# EAGLE design grndstn (EAGLE 5.07)
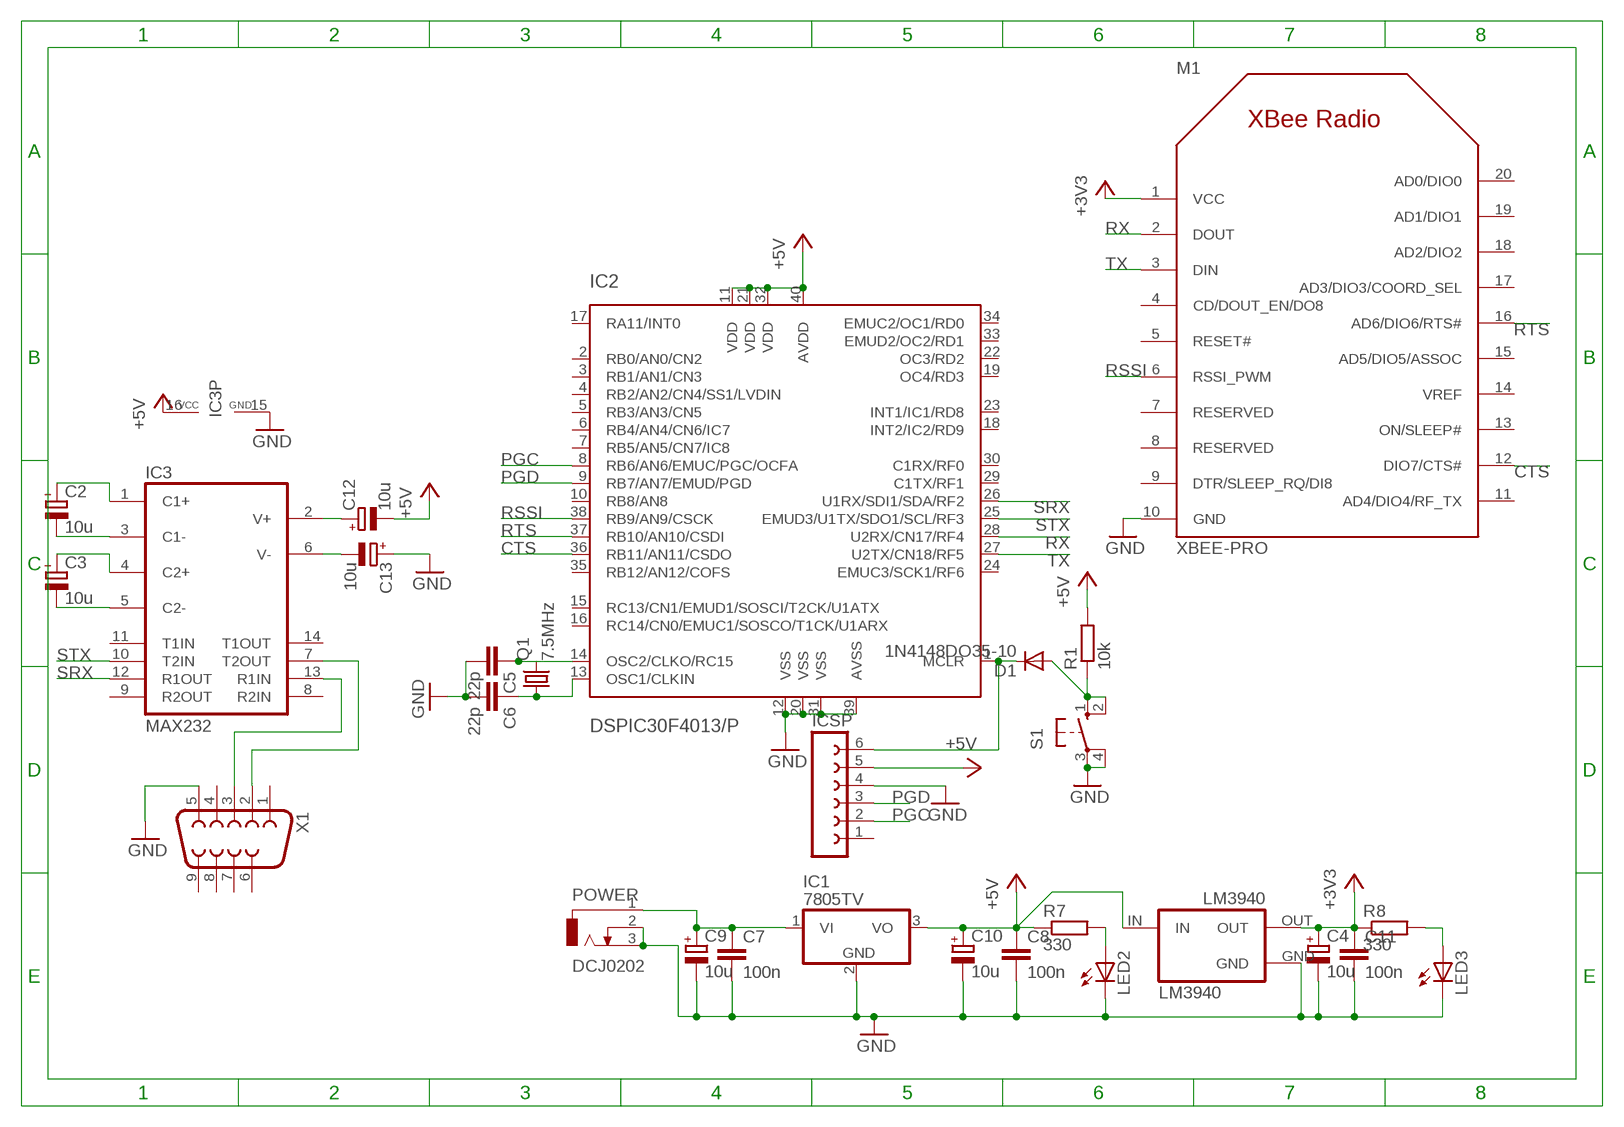
[diagram p0: schematic, sheet 1]

## Parts
C2  10u  CPOL-EUB45181A  [B45181A]
C3  10u  CPOL-EUB45181A  [B45181A]
C4  10u  CPOL-EUB45181A  [B45181A]
C5  22p  C-EU050-025X075  [C050-025X075]
C6  22p  C-EU050-025X075  [C050-025X075]
C7  100n  C-EU050-025X075  [C050-025X075]
C8  100n  C-EU050-025X075  [C050-025X075]
C9  10u  CPOL-EUB45181A  [B45181A]
C10  10u  CPOL-EUB45181A  [B45181A]
C11  100n  C-EU050-025X075  [C050-025X075]
C12  10u  CPOL-EUB45181A  [B45181A]
C13  10u  CPOL-EUB45181A  [B45181A]
D1  1N4148DO35-10  [DO35-10]
IC1  7805TV  [TO220V]
IC2  DSPIC30F4013/P  [DIL40]
IC3  MAX232  [DIL16]
ICSP  FE06-1  [FE06]
LED2  LED3MM  [LED3MM]
LED3  LED3MM  [LED3MM]
LM3940  LM3940  [TO220(V)]
M1  XBEE-PRO  [XBEE-PRO]
POWER  DCJ0202  [DCJ0202]
Q1  7.5MHz  CRYSTALHC18U-V  [HC18U-V]
R1  10k  R-EU_0207/10  [0207/10]
R7  330  R-EU_0207/10  [0207/10]
R8  330  R-EU_0207/10  [0207/10]
S1  10-XX  [B3F-10XX]
X1  F09HP  [F09HP]

## Nets
+3V3: C4.+ C11.1 LM3940.OUT M1.1(VCC) R8.1
+5V: C8.1 C10.+ C12.- IC1.3(VO) IC2.11(VDD) IC2.21(VDD) IC2.32(VDD) IC2.40(AVDD) IC3.16(VCC) ICSP.5 LM3940.IN R1.2 R7.1
CTS: IC2.36(RB11/AN11/CSDO) M1.12(DIO7/CTS#)
GND: C4.- C5.2 C6.2 C7.2 C8.2 C9.- C10.- C11.2 C13.+ IC1.2(GND) IC2.12(VSS) IC2.20(VSS) IC2.31(VSS) IC2.39(AVSS) IC3.15(GND) ICSP.4 LED2.K(C) LED3.K(C) LM3940.GND M1.10(GND) POWER.2 POWER.3 S1.3(P) S1.4(P1) X1.5
MCLR: D1.C IC2.1(MCLR) ICSP.6
N$1: LED3.A R8.2
N$2: C5.1 IC2.14(OSC2/CLKO/RC15) Q1.2
N$3: C12.+ IC3.2(V+)
N$4: C6.1 IC2.13(OSC1/CLKIN) Q1.1
N$5: C13.- IC3.6(V-)
N$6: C2.+ IC3.1(C1+)
N$7: C7.1 C9.+ IC1.1(VI) POWER.1
N$8: C2.- IC3.3(C1-)
N$9: C3.+ IC3.4(C2+)
N$10: C3.- IC3.5(C2-)
N$11: IC3.7(T2OUT) X1.2
N$12: IC3.13(R1IN) X1.3
N$14: D1.A R1.1 S1.1(S) S1.2(S1)
N$16: LED2.A R7.2
PGC: IC2.8(RB6/AN6/EMUC/PGC/OCFA) ICSP.2
PGD: IC2.9(RB7/AN7/EMUD/PGD) ICSP.3
RSSI: IC2.38(RB9/AN9/CSCK) M1.6(RSSI_PWM)
RTS: IC2.37(RB10/AN10/CSDI) M1.16(AD6/DIO6/RTS#)
RX: IC2.28(U2RX/CN17/RF4) M1.2(DOUT)
SRX: IC2.26(U1RX/SDI1/SDA/RF2) IC3.12(R1OUT)
STX: IC2.25(EMUD3/U1TX/SDO1/SCL/RF3) IC3.10(T2IN)
TX: IC2.27(U2TX/CN18/RF5) M1.3(DIN)
Unconnected: IC2.2(RB0/AN0/CN2) IC2.3(RB1/AN1/CN3) IC2.4(RB2/AN2/CN4/SS1/LVDIN) IC2.5(RB3/AN3/CN5) IC2.6(RB4/AN4/CN6/IC7) IC2.7(RB5/AN5/CN7/IC8) IC2.10(RB8/AN8) IC2.15(RC13/CN1/EMUD1/SOSCI/T2CK/U1ATX) IC2.16(RC14/CN0/EMUC1/SOSCO/T1CK/U1ARX) IC2.17(RA11/INT0) IC2.18(INT2/IC2/RD9) IC2.19(OC4/RD3) IC2.22(OC3/RD2) IC2.23(INT1/IC1/RD8) IC2.24(EMUC3/SCK1/RF6) IC2.29(C1TX/RF1) IC2.30(C1RX/RF0) IC2.33(EMUD2/OC2/RD1) IC2.34(EMUC2/OC1/RD0) IC2.35(RB12/AN12/COFS) IC3.8(R2IN) IC3.9(R2OUT) IC3.11(T1IN) IC3.14(T1OUT) ICSP.1 M1.4(CD/DOUT_EN/DO8) M1.5(RESET#) M1.7(RESERVED) M1.8(RESERVED) M1.9(DTR/SLEEP_RQ/DI8) M1.11(AD4/DIO4/RF_TX) M1.13(ON/SLEEP#) M1.14(VREF) M1.15(AD5/DIO5/ASSOC) M1.17(AD3/DIO3/COORD_SEL) M1.18(AD2/DIO2) M1.19(AD1/DIO1) M1.20(AD0/DIO0) X1.1 X1.4 X1.6 X1.7 X1.8 X1.9

## Library data of the parts
C2-C4 C9 C10 C12 C13 = rcl:CPOL-EU: POLARIZED CAPACITOR, European symbol
C5-C8 C11 = rcl:C-EU: CAPACITOR, European symbol
D1 = diode:1N4148: DIODE high speed (Philips)
IC1 = linear:78*: Positive VOLTAGE REGULATOR Source: http://cache.national.com/ds/LM/LM78L05.pdf http://www.fairchildsemi.com/ds/LM/LM7805.pdf
IC2 = microchip-dspic:DSPIC30F4013: dsPIC General DSC with CAN and CoDec ports
IC3 = maxim:MAX232: RS232 TRANSEIVER
ICSP = con-lsta:FE06-1: FEMALE HEADER
LED2 LED3 = led:LED: LED OSRAM: - CHIPLED LG R971, LG N971, LY N971, LG Q971, LY Q971, LO R971, LY R971 LH N974, LH R974 LS Q976, LO Q976, LY Q976 LO Q996 - Hyper CHIPLED LW Q18S LB Q993, LB Q99A, LB R99A - SideLED LS A670, LO A670, LY A670, LG A670, LP A670 LB A673, LV A673, LT A673, LW A673 LH A674 LY A675 LS A676, LA A676, LO A676, LY A676, LW A676 LS A679, LY A679, LG A679 - Hyper Micro SIDELED® LS Y876, LA Y876, LO Y876, LY Y876 LT Y87S - SmartLED LW L88C, LW L88S LB L89C, LB L89S, LG L890 LS L89K, LO L89K, LY L89K LS L896, LA L896, LO L896, LY L896 - TOPLED LS T670, LO T670, LY T670, LG T670, LP T670 LSG T670, LSP T670, LSY T670, LOP T670, LYG T670 LG T671, LOG T671, LSG T671 LB T673, LV T673, LT T673, LW T673 LH T674 LS T676, LA T676, LO T676, LY T676, LB T676, LH T676, LSB T676, LW T676 LB T67C, LV T67C, LT T67C, LS T67K, LO T67K, LY T67K, LW E67C LS E67B, LA E67B, LO E67B, LY E67B, LB E67C, LV E67C, LT E67C LW T67C LS T679, LY T679, LG T679 LS T770, LO T770, LY T770, LG T770, LP T770 LB T773, LV T773, LT T773, LW T773 LH T774 LS E675, LA E675, LY E675, LS T675 LS T776, LA T776, LO T776, LY T776, LB T776 LHGB T686 LT T68C, LB T68C - Hyper Mini TOPLED® LB M676 - Mini TOPLED Santana® LG M470 LS M47K, LO M47K, LY M47K Source: http://www.osram.convergy.de LUXEON: - LUMILED® LXK2-PW12-R00, LXK2-PW12-S00, LXK2-PW14-U00, LXK2-PW14-V00 LXK2-PM12-R00, LXK2-PM12-S00, LXK2-PM14-U00 LXK2-PE12-Q00, LXK2-PE12-R00, LXK2-PE12-S00, LXK2-PE14-T00, LXK2-PE14-U00 LXK2-PB12-K00, LXK2-PB12-L00, LXK2-PB12-M00, LXK2-PB14-N00, LXK2-PB14-P00, LXK2-PB14-Q00 LXK2-PR12-L00, LXK2-PR12-M00, LXK2-PR14-Q00, LXK2-PR14-R00 LXK2-PD12-Q00, LXK2-PD12-R00, LXK2-PD12-S00 LXK2-PH12-R00, LXK2-PH12-S00 LXK2-PL12-P00, LXK2-PL12-Q00, LXK2-PL12-R00 Source: www.luxeon.com KINGBRIGHT: KA-3528ASYC Source: www.kingbright.com
LM3940 = lm2937:LM3940
M1 = xbee_r1:XBEE
POWER = con-jack:DCJ0202: DC POWER JACK Source: DCJ0202.pdf
Q1 = crystal:CRYSTAL: CRYSTAL
R1 R7 R8 = rcl:R-EU_: RESISTOR, European symbol
S1 = switch-omron:10-XX: OMRON SWITCH
X1 = con-subd:F09: SUB-D

## Board
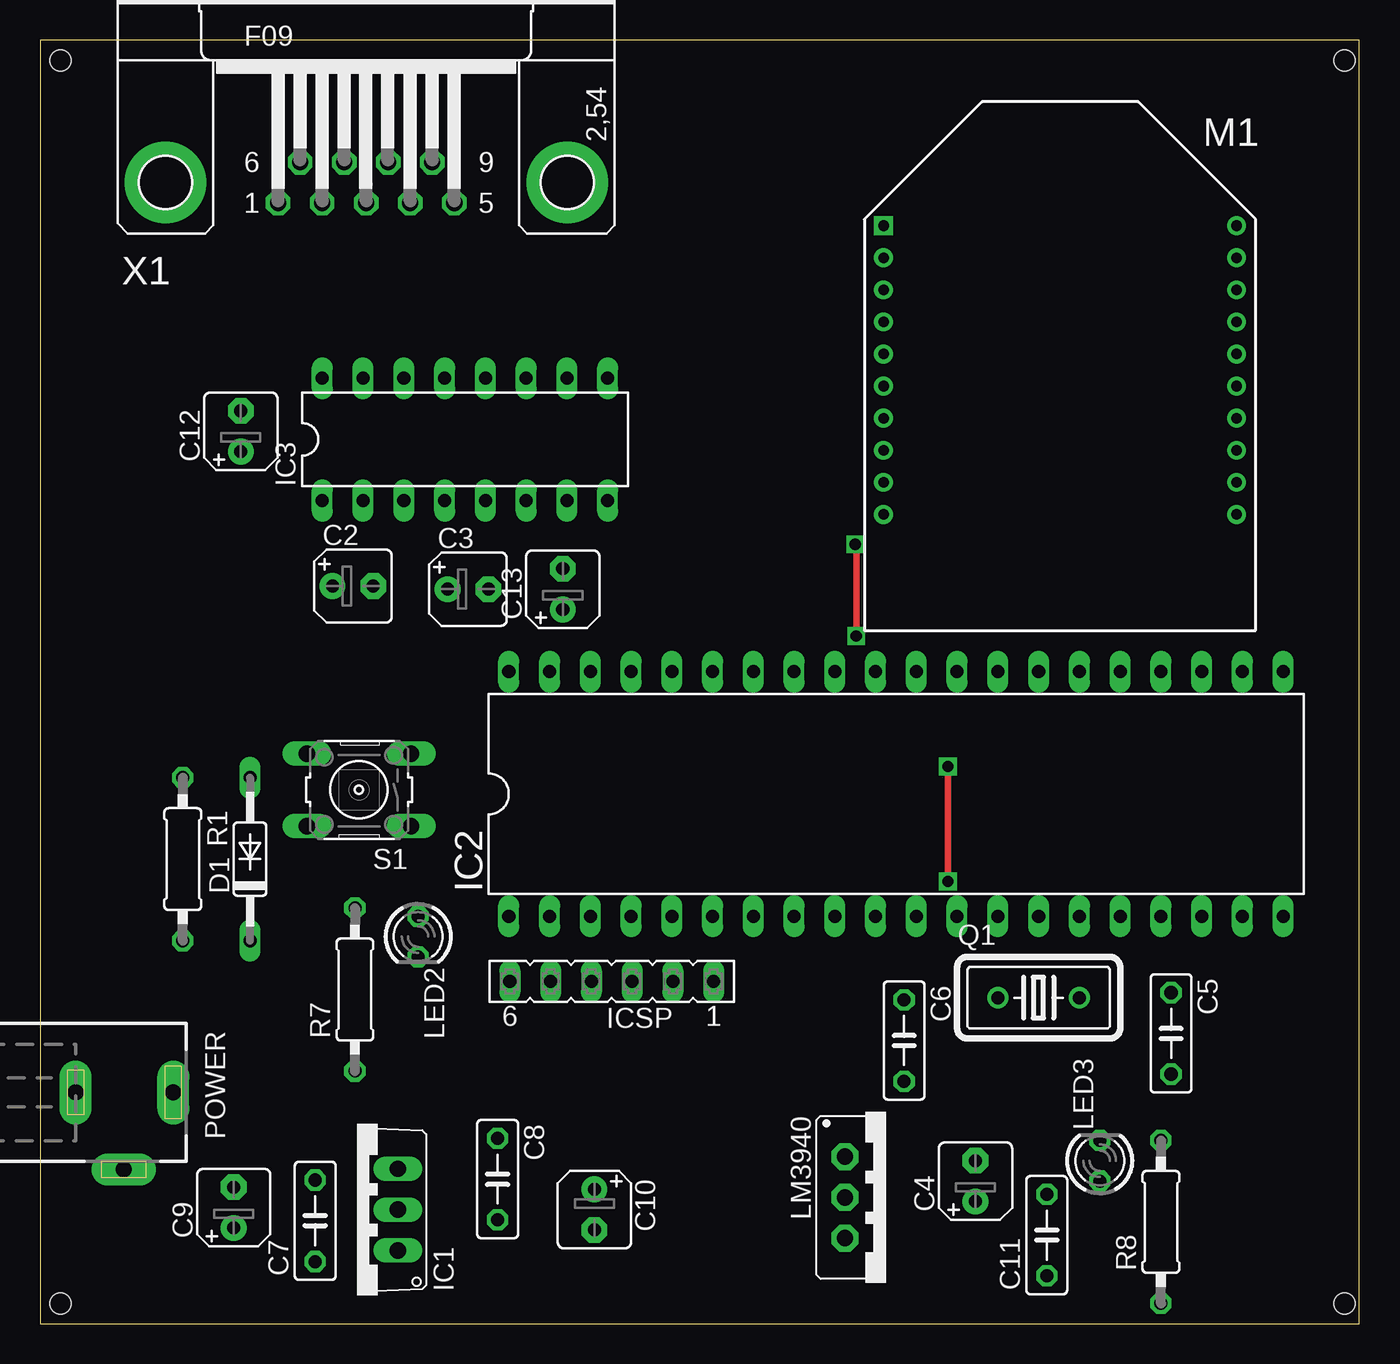
[diagram p1: board, top side]
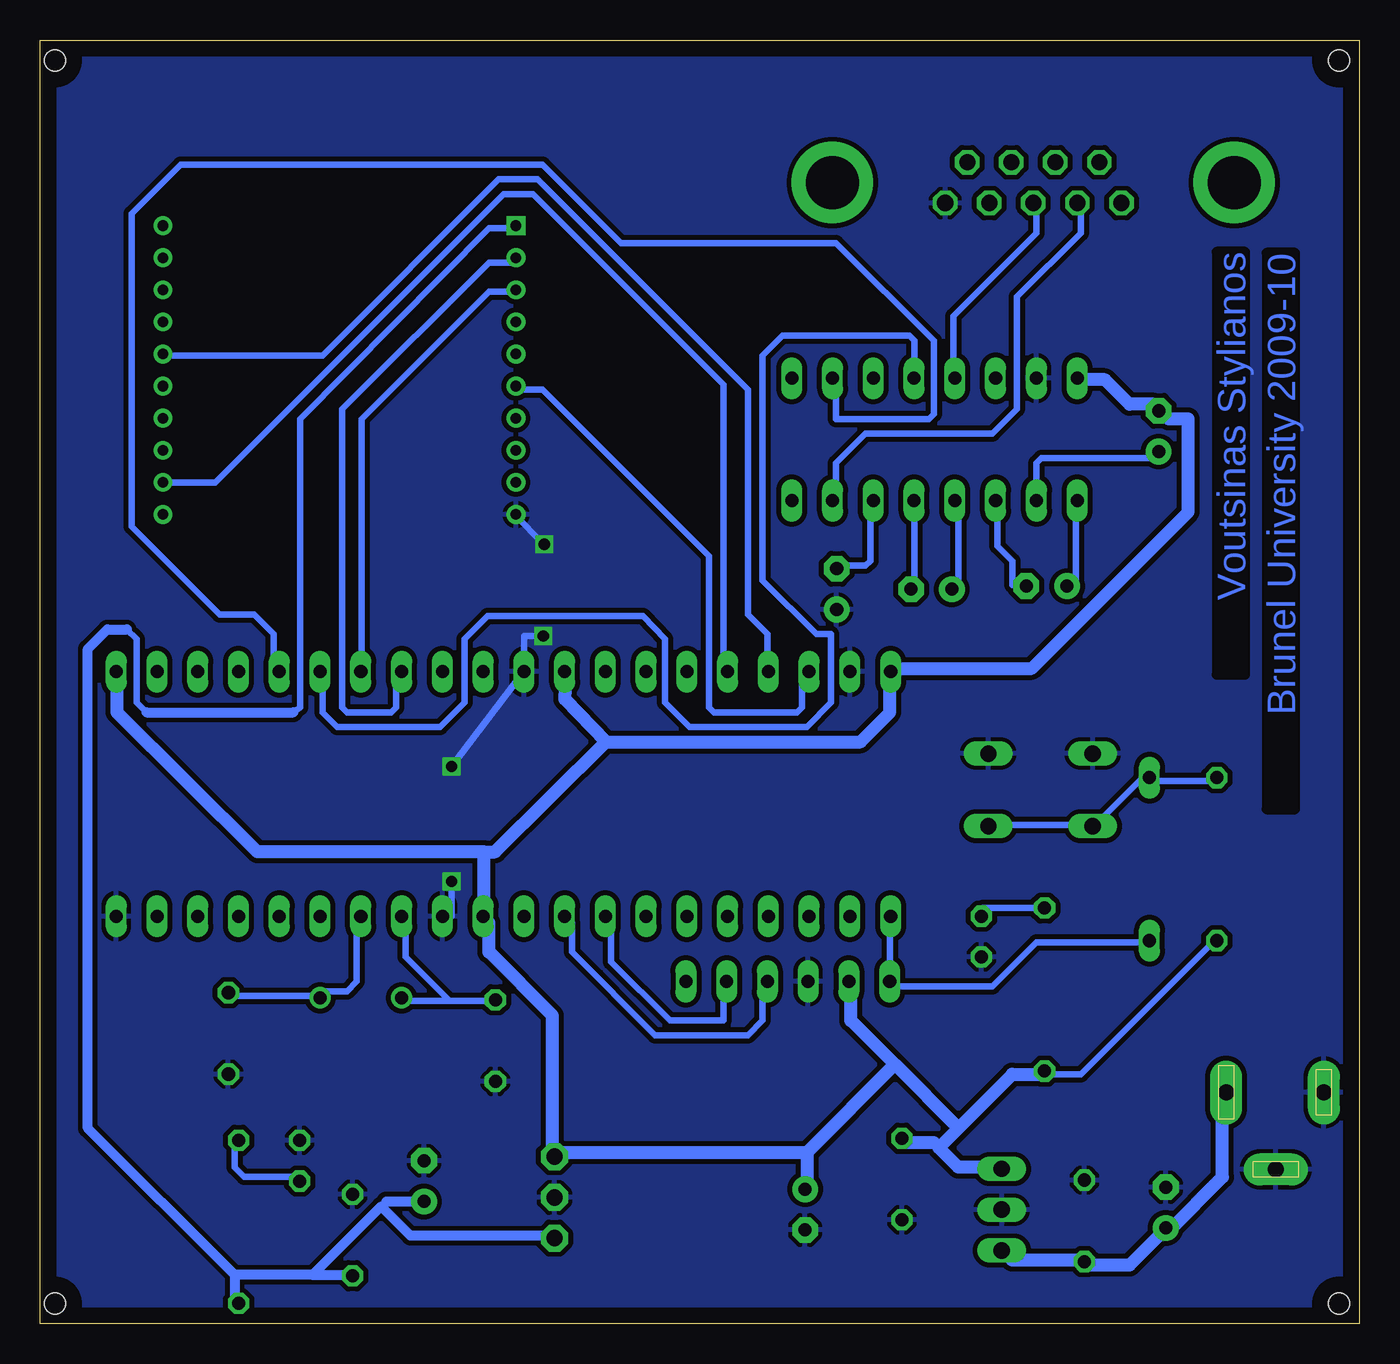
[diagram p2: board, bottom side, seen from below]

Size 82.22 x 80 mm. Coordinates in mm from the lower left corner, seen from the top.
Outline: 0,0 82.22,0 82.22,80 0,80 0,0
Copper layers (1*16): Top 0.035mm / dielectric 1.5mm / Bottom 0.035mm
Design rules "default *": minimum track width 16mil, minimum drill 24mil, track to track 12mil, track to pad 12mil, pad to pad 8mil, via to via 8mil, smd to smd 8mil, copper to edge 40mil, drill to drill 8mil, minimum pad ring 10mil, minimum via ring 8mil, stop-mask expansion 4mil, vias tented up to drill 0mil, thermal gap 10mil
Holes 1.3 mm at 1.27,78.74 1.27,1.27 81.28,78.74 81.28,1.27

### Footprints (pad centres in the part's own frame; a part is rotated, then mirrored left to right if it is on the bottom)
B45181A = drill 0.813 pad 1.6 round: + -1.27,0 | drill 0.813 pad 1.6 octagon: - 1.27,0
C050-025X075 = drill 0.813 octagon: 1 -2.54,0; 2 2.54,0
DO35-10 = drill 0.813 long: A 5.08,0; C -5.08,0
TO220V = drill 1.016 long: 1 -2.54,-2.54; 2 0,-2.54; 3 2.54,-2.54
DIL40 = drill 0.813 long: 1 -24.13,-7.62; 2 -21.59,-7.62; 3 -19.05,-7.62; 4 -16.51,-7.62; 5 -13.97,-7.62; 6 -11.43,-7.62; 7 -8.89,-7.62; 8 -6.35,-7.62; 9 -3.81,-7.62; 10 -1.27,-7.62; 11 1.27,-7.62; 12 3.81,-7.62; 13 6.35,-7.62; 14 8.89,-7.62; 15 11.43,-7.62; 16 13.97,-7.62; 17 16.51,-7.62; 18 19.05,-7.62; 19 21.59,-7.62; 20 24.13,-7.62; 21 24.13,7.62; 22 21.59,7.62; 23 19.05,7.62; 24 16.51,7.62; 25 13.97,7.62; 26 11.43,7.62; 27 8.89,7.62; 28 6.35,7.62; 29 3.81,7.62; 30 1.27,7.62; 31 -1.27,7.62; 32 -3.81,7.62; 33 -6.35,7.62; 34 -8.89,7.62; 35 -11.43,7.62; 36 -13.97,7.62; 37 -16.51,7.62; 38 -19.05,7.62; 39 -21.59,7.62; 40 -24.13,7.62
DIL16 = drill 0.813 long: 1 -8.89,-3.81; 2 -6.35,-3.81; 3 -3.81,-3.81; 4 -1.27,-3.81; 5 1.27,-3.81; 6 3.81,-3.81; 7 6.35,-3.81; 8 8.89,-3.81; 9 8.89,3.81; 10 6.35,3.81; 11 3.81,3.81; 12 1.27,3.81; 13 -1.27,3.81; 14 -3.81,3.81; 15 -6.35,3.81; 16 -8.89,3.81
FE06 = drill 0.813 long: 1 -6.35,0; 2 -3.81,0; 3 -1.27,0; 4 1.27,0; 5 3.81,0; 6 6.35,0
LED3MM = drill 0.813 octagon: A -1.27,0; K 1.27,0
TO220(V) = drill 1.016 pad 1.676 octagon: GND 0,0; IN -2.54,0; OUT 2.54,0
XBEE-PRO = drill 0.66 square: 1 -11,9 | drill 0.66 round: 2 -11,7; 3 -11,5; 4 -11,3; 5 -11,1; 6 -11,-1; 7 -11,-3; 8 -11,-5; 9 -11,-7; 10 -11,-9; 11 11,-9; 12 11,-7; 13 11,-5; 14 11,-3; 15 11,-1; 16 11,1; 17 11,3; 18 11,5; 19 11,7; 20 11,9
DCJ0202 = drill 1 pad 2 long: 1 0,3.1; 2 4.8,0; 3 0,-3
HC18U-V = drill 0.813 round: 1 -2.54,0; 2 2.54,0
0207/10 = drill 0.813 octagon: 1 -5.08,0; 2 5.08,0
B3F-10XX = drill 1.016 long: 1 -3.251,2.261; 2 3.251,2.261; 3 -3.251,-2.261; 4 3.251,-2.261
F09HP = drill 1.016 octagon: 1 -5.486,-1.27; 2 -2.743,-1.27; 3 0,-1.27; 4 2.743,-1.27; 5 5.486,-1.27; 6 -4.115,1.27; 7 -1.372,1.27; 8 1.372,1.27; 9 4.115,1.27 | drill 3.302 pad 5.08 round: G1 -12.522,0; G2 12.522,0

### Placement (x,y rotation side)
C2  19.49,45.97 0 top
C3  26.67,45.78 0 top
C4  58.29,8.89 90 top
C5  70.48,18.1 270 top
C6  53.85,17.65 270 top
C7  17.14,6.41 90 top
C8  28.51,9.02 270 top
C9  12.06,7.24 90 top
C10  34.54,7.11 270 top
C11  62.74,5.52 90 top
C12  12.51,55.63 90 top
C13  32.58,45.78 90 top
D1  13.08,28.96 90 top
IC1  19.75,7.11 90 top
IC2  53.34,33.02 0 top
IC3  26.48,55.12 0 top
ICSP  35.62,21.34 180 top
LED2  23.56,24.13 270 top
LED3  66.04,10.16 90 top
LM3940  50.16,7.87 270 top
M1  63.56,59.44 0 top
POWER  5.21,14.41 270 top
Q1  62.23,20.32 0 top
R1  8.89,28.96 270 top
R7  19.62,20.83 90 top
R8  69.85,6.35 90 top
S1  19.88,33.27 180 top
X1  20.32,71.12 0 top

### Tracks (layer width: path | path; a pad name or v marks a point on that pad's centre or on a via)
+3V3
  Bottom 0.406: 66.45,38.1 66.02,38.41 66.02,56.39 54.25,68.28 52.73,68.28 M1.1 | 75.59,38.1 76.2,38.71 76.2,42.67 76.81,43.28 | 70.1,1.52 R8.1 | 62.79,3.05 C11.1 | 60.96,7.32 60.66,7.62 | LM3940.OUT 50.29,5.49
  Bottom 0.61: 75.59,38.1 66.45,38.1 | 76.81,43.28 78.03,43.28 79.25,42.06 79.25,12.19 70.1,3.05 | 70.1,3.05 70.1,1.52 | 65.23,3.05 70.1,3.05 | 65.23,3.05 62.79,3.05 | 65.23,3.05 60.96,7.32 59.13,5.49 50.29,5.49 | 60.66,7.62 C4.+
+5V
  Bottom 0.406: 26.21,10.97 26.52,11.28 | 28.35,11.28 C8.1 | IC1.3 22.55,9.75 | 19.81,15.54 R7.1 19.51,15.54 17.37,15.54 9.14,23.77 R1.2 | 31.7,21.34 ICSP.5 | 34.44,8.53 C10.+ | 49.99,10.67 LM3940.IN 50.29,10.67 | 17.37,58.83 IC3.16 | 12.5,57 C12.- 12.5,56.69 12.19,56.69 | 49.45,40.3 49.38,40.54 IC2.32 | 29.26,40.54 IC2.40 28.96,40.84 | 77.42,40.54 IC2.21 | 54.25,24.99 54.56,25.3 IC2.11 54.56,25.6
  Bottom 0.813: 26.52,11.28 28.35,11.28 | 22.55,9.75 24.99,9.75 26.21,10.97 24.99,12.19 | 19.81,15.54 21.64,15.54 24.99,12.19 | 31.7,21.34 31.7,18.9 28.96,16.15 | 24.99,12.19 28.96,16.15 | 34.44,10.67 34.44,8.53 | 28.96,16.15 34.44,10.67 | 34.44,10.67 49.99,10.67 | 17.37,58.83 15.85,58.83 14.33,57.3 12.8,57.3 12.5,57 | 29.26,40.54 29.26,38.1 31.09,36.27 46.94,36.27 | 46.94,36.27 49.52,38.91 49.45,40.3 | 46.94,36.27 53.86,29.41 54.56,29.41 | 77.42,40.54 77.42,38.1 68.67,29.41 54.56,29.41 | 12.19,56.69 11.89,56.39 10.67,56.39 10.67,50.6 20.42,40.84 28.96,40.84 | 50.29,10.67 50.29,19.2 54.25,23.16 54.25,24.99 | 54.56,25.6 54.56,29.41
CTS
  Bottom 0.406: M1.12 74.37,52.43 71.32,52.43 53.34,70.41 51.51,70.41 39.62,58.52 39.62,40.84 IC2.36
GND  (via drill 0.7)
  Top 0.406: v50.8,48.58 50.86,48.51 v50.86,42.86 | v56.58,27.56 v56.58,34.73
  Bottom 0.406: M1.10 52.64,50.44 v50.8,48.58 | v50.86,42.86 52.07,42.86 IC2.31 52.13,40.58 v56.58,34.73 | IC2.12 56.58,25.4 v56.58,27.56
  pour Bottom: 0,80.01 82.55,80.01 82.55,0 0,0
MCLR
  Bottom 0.406: 28.96,21.03 ICSP.6 | ICSP.6 29.26,25.3 IC2.1 | ICSP.6 28.96,21.03 | 28.96,21.03 22.86,21.03 20.12,23.77 13.11,23.77 D1.C
N$1
  Bottom 0.406: LED3.A 66.14,9.14 69.49,9.14 70.1,9.75 70.1,11.28 R8.2
N$2
  Bottom 0.406: 64.92,20.42 70.41,20.42 C5.1 | 64.92,20.42 64.62,20.73 63.09,20.73 62.48,21.34 62.48,25.3 IC2.14 | 64.92,20.42 Q1.2
N$3
  Bottom 0.406: IC3.2 20.12,51.51 20.12,53.65 19.81,53.95 12.8,53.95 12.5,54.25 C12.+
N$4
  Bottom 0.406: 56.69,20.12 59.44,20.12 Q1.1 | 56.69,20.12 53.95,20.12 C6.1 | 56.69,20.12 59.44,22.86 59.44,25.3 IC2.13
N$5
  Bottom 0.406: IC3.6 30.48,51.21 30.48,47.55 30.79,47.24 32.31,47.24 C13.-
N$6
  Bottom 0.406: IC3.1 17.68,51.21 17.68,46.02 17.98,45.72 C2.+
N$7
  Bottom 0.406: 21.64,3.96 22.25,4.57 IC1.1 | 17.37,3.96 C7.1 17.07,3.66 | 12.19,5.79 C9.+ 11.89,5.79 | 8.53,14.33 POWER.1
  Bottom 0.813: 17.37,3.96 21.64,3.96 | 12.19,5.79 14.33,3.66 17.07,3.66 | 8.53,14.33 8.53,9.14 11.89,5.79
N$8
  Bottom 0.406: IC3.3 22.55,51.21 22.55,48.46 21.64,47.55 21.64,46.02 21.03,46.02 C2.-
N$9
  Bottom 0.406: IC3.4 24.99,51.21 24.99,46.02 25.3,45.72 C3.+
N$10
  Bottom 0.406: IC3.5 27.74,51.21 27.74,46.02 C3.-
N$11
  Bottom 0.406: IC3.7 32.61,51.51 32.61,53.65 30.79,55.47 22.86,55.47 21.34,57 21.34,64.01 17.37,67.97 17.37,69.8 X1.2
N$12
  Bottom 0.406: IC3.13 25.3,59.13 25.3,62.79 20.12,67.97 20.12,69.8 X1.3
N$14
  Bottom 0.406: R1.1 9.14,33.83 12.8,33.83 D1.A 13.11,33.83 13.72,33.83 16.46,31.09 S1.2 16.76,31.09 22.86,31.09 S1.1
N$16
  Bottom 0.406: R7.2 23.47,25.91 23.77,25.6 LED2.A
PGC
  Bottom 0.406: ICSP.2 39.62,21.34 39.62,18.9 42.98,18.9 46.63,22.55 46.63,24.99 46.94,25.3 IC2.8
PGD
  Bottom 0.406: ICSP.3 37.19,21.34 37.19,18.9 38.1,17.98 43.89,17.98 49.07,23.16 49.07,24.99 49.38,25.3 IC2.9
RSSI
  Bottom 0.406: M1.6 52.43,58.22 50.9,58.22 40.54,47.85 40.54,38.41 40.23,38.1 35.05,38.1 34.75,38.41 34.75,39.93 34.14,40.54 IC2.38
RTS
  Bottom 0.406: M1.16 74.37,60.35 64.62,60.35 53.65,71.32 51.21,71.32 38.1,58.22 38.1,44.2 36.88,42.98 36.88,40.84 IC2.37
RX
  Bottom 0.406: M1.2 52.73,66.14 54.25,66.14 63.4,57 63.4,38.41 63.09,38.1 60.35,38.1 60.05,38.41 60.05,40.23 59.74,40.54 IC2.28
SRX
  Bottom 0.406: IC2.26 64.62,40.54 64.62,38.1 63.7,37.19 57.3,37.19 55.78,38.71 55.78,42.67 54.34,44.11 44.65,44.11 43.28,42.67 43.28,38.71 41.76,37.19 34.44,37.19 32.92,38.71 32.92,42.98 33.83,42.98 37.19,46.33 37.19,60.35 35.97,61.57 28.04,61.57 27.74,61.27 27.74,59.13 IC3.12
STX
  Bottom 0.406: IC3.10 32.61,58.83 32.61,56.39 26.82,56.39 26.52,56.69 26.52,61.27 32.61,67.36 46.02,67.36 50.9,72.24 73.46,72.24 76.5,69.19 76.5,49.68 71.02,44.2 68.89,44.2 67.67,42.98 67.67,41.15 67.36,40.84 IC2.25
TX
  Bottom 0.406: M1.3 52.73,64.31 54.25,64.31 62.18,56.39 62.18,40.84 IC2.27

### Text on the board
Bottom: Brunel University 2009-10 | Voutsinas Stylianos